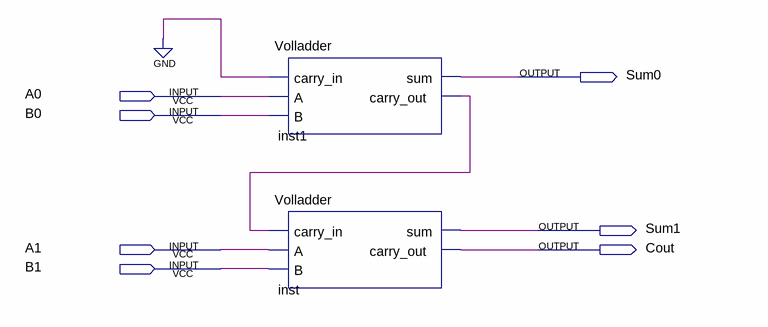
[diagram p0: schematic sheet]
// Quartus schematic carry_ripple.bdf as structural Verilog: 2 symbols, 7 pins
module carry_ripple (
  input  A0,
  input  B0,
  input  A1,
  input  B1,
  output Sum0,
  output Sum1,
  output Cout
);

  wire inst1_carry_out;

  Volladder inst1 (.carry_in(1'b0), .A(A0), .B(B0), .sum(Sum0), .carry_out(inst1_carry_out));
  Volladder inst (.carry_in(inst1_carry_out), .A(A1), .B(B1), .sum(Sum1), .carry_out(Cout));
endmodule
